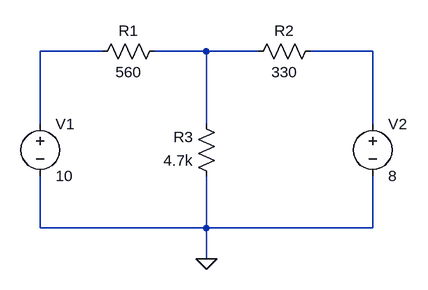
[diagram p0: schematic Schema1.asc]
Schema1.asc, the LTspice schematic file:
Version 4
SHEET 1 880 680
WIRE 0 -16 -96 -16
WIRE 160 -16 80 -16
WIRE 240 -16 160 -16
WIRE 416 -16 320 -16
WIRE -96 96 -96 -16
WIRE 160 96 160 -16
WIRE 416 96 416 -16
WIRE -96 256 -96 176
WIRE 160 256 160 176
WIRE 160 256 -96 256
WIRE 416 256 416 176
WIRE 416 256 160 256
WIRE 160 304 160 256
FLAG 160 304 0
SYMBOL voltage -96 80 R0
WINDOW 123 0 0 Left 0
WINDOW 39 0 0 Left 0
SYMATTR InstName V1
SYMATTR Value 10
SYMBOL voltage 416 80 R0
WINDOW 123 0 0 Left 0
WINDOW 39 0 0 Left 0
SYMATTR InstName V2
SYMATTR Value 8
SYMBOL res 96 -32 R90
WINDOW 0 0 56 VBottom 2
WINDOW 3 32 56 VTop 2
SYMATTR InstName R1
SYMATTR Value 560
SYMBOL res 336 -32 R90
WINDOW 0 0 56 VBottom 2
WINDOW 3 32 56 VTop 2
SYMATTR InstName R2
SYMATTR Value 330
SYMBOL res 176 192 R180
WINDOW 0 36 76 Left 2
WINDOW 3 36 40 Left 2
SYMATTR InstName R3
SYMATTR Value 4.7k

The netlist it stands for:
* Schema1.asc
V1 N001 0 10
V2 N003 0 8
R1 N002 N001 560
R2 N003 N002 330
R3 0 N002 4.7k
.backanno
.end